# Altium schematic sheet Relay_Latches.SchDoc
size A3; SheetNumber: 4; SheetTotal: 6
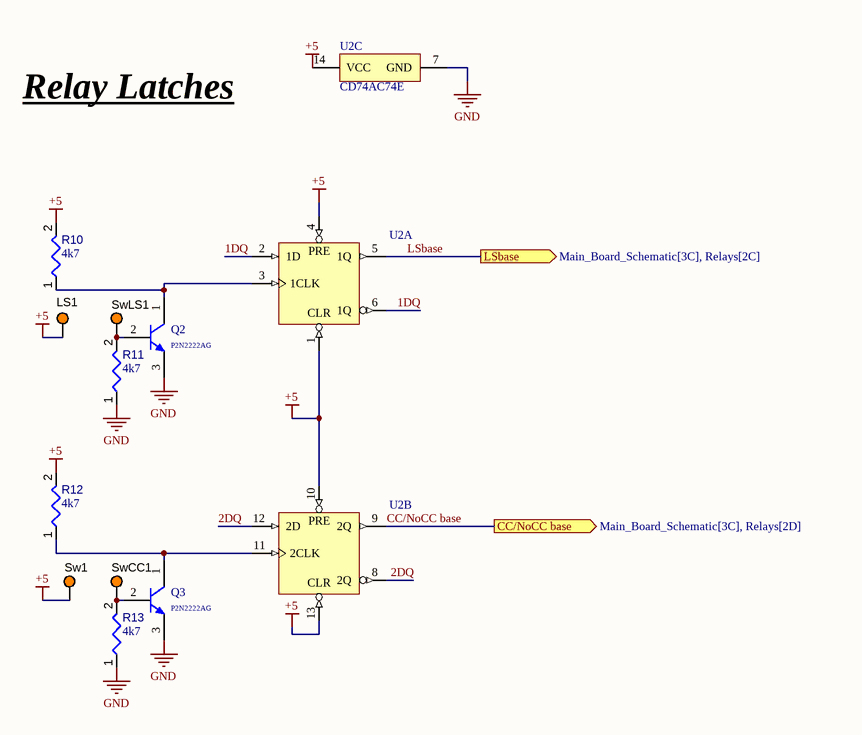
[diagram p0: Relay_Latches.SchDoc]

## Parts
LS1  5003  [KSTN-5003]  (value not drawn)
Q2  P2N2222AG  [ONSC-TO-92-3-29-11]
Q3  P2N2222AG  [ONSC-TO-92-3-29-11]
R10  value 4k7  [RESA60-630X240]  (hidden comment: MFR-25FBF52-100R)
R11  value 4k7  [RESA60-630X240]  (hidden comment: MFR-25FBF52-100R)
R12  value 4k7  [RESA60-630X240]  (hidden comment: MFR-25FBF52-100R)
R13  value 4k7  [RESA60-630X240]  (hidden comment: MFR-25FBF52-100R)
Sw1  5003  [KSTN-5003]  (value not drawn)
SwCC1  5003  [KSTN-5003]  (value not drawn)
SwLS1  5003  [KSTN-5003]  (value not drawn)
U2  CD74AC74E  [N0014A]  (value not drawn)  (parts A,B,C of 3)

## Ports
CC/NoCC base (out, see Main_Board_Schematic[3C], Relays[2D]), LSbase (out, see Main_Board_Schematic[3C], Relays[2C])

## Nets
+5: LS1.1 R10.2 R12.2 Sw1.1 U2.1(1~{CLR}) U2.4(1~{PRE}) U2.10(2~{PRE}) U2.13(2~{CLR}) U2.14(VCC)
GND: Q2.3(E) Q3.3(E) R11.1 R13.1 U2.7(GND)
1DQ: U2.2(1D) U2.6(1Q)
2DQ: U2.8(2Q) U2.12(2D)
CC/NoCC base: U2.9(2Q) ; port CC/NoCC base
LSbase: U2.5(1Q) ; port LSbase
NetQ2_1: Q2.1(C) R10.1 U2.3(1CLK)
NetQ2_2: Q2.2(B) R11.2 SwLS1.1
NetQ3_1: Q3.1(C) R12.1 U2.11(2CLK)
NetQ3_2: Q3.2(B) R13.2 SwCC1.1

## Notes on the sheet
- Relay Latches
- (in symbol CMP-1619-00741-2, part A) PRE; CLR
- (in symbol CMP-1619-00741-2, part B) PRE; CLR

## Library data of the parts
LS1 Sw1 SwCC1 SwLS1 = CMP-002-00037-2: Test Point, Orange, Height 4.6 mm, Tail Length 3 mm, 1-Pin THD, RoHS; Manufacturer: Keystone; Colour: Orange; Packaging: Bulk; Package Description: 1-Pin Through Hole Device, Dia 2.54 mm; Pins: 1; Package Reference: 5003; Datasheet Version: Jun-15; Case/Package: 5003; Mounting Technology: TH; Connector Type: TestPoint; Diameter: 2.54mm; Contact Material: Bronze; Datasheet URL: http://keyelco.com/userAssets/file/M65p56.pdf; Manufacturer URL: http://www.keyelco.com/; Package Quantity: 10; Contact Plating: Tin; RoHS Compliant: True
Q2 Q3 = CMP-1048-01402-1: Amplifier Transistor, NPN Silicon, 3-Pin TO-92, Pb-Free, Bulk Box; Manufacturer: On Semiconductor; IC Continuous (A): 0.6; fT Min (MHz): 300; ComponentLink2Description: Datasheet; ComponentLink1Description: Manufacturer URL; ComponentLink2URL: http://www.onsemi.com/pub_link/Collateral/P2N2222A-D.PDF; ComponentLink3Description: Package Specification; RoHS: TRUE; ComponentLink1URL: http://www.onsemi.com/; PartNumber: P2N2222AG; Mounting Technology: Through Hole; PackageReference: TO-92-3-29-11_AM_SL; Polarity: NPN; Packing: Bulk Box; DatasheetVersion: Rev. 7; PackageDescription: 3-Pin Transistor Outline, Body 4.825 x 3.685 mm, Pitch 1.27 mm; PackageVersion: Rev. AM; ComponentLink3URL: http://www.onsemi.cn/pub_link/Collateral/2N6426-D.PDF
R10-R13 = CMP-009-00046-4: Axial Resistor, 100 Ohm, +/- 1%, 0.25 W, -55 to 155 degC, 2-Pin THD, RoHS, Bulk; Manufacturer: Yageo; Voltage Rating: 250V; Power: 250mW; Packaging: Bulk; Max Operating Temperature: 155°C; Mounting Technology: TH; Datasheet Version: Apr-13; Case/Package: Axial; RoHS Compliant: True; Package Description: 2-Pin Axial Lead, Dia 2.4 mm, Body Length 6.3 mm; Package Quantity: 200; Package Reference: MFR-25; Tolerance: 1%; Composition: CarbonFilm; Datasheet URL: http://www.yageo.com/documents/recent/Yageo%20LR_MFR_2013.pdf; Manufacturer URL: http://www.yageo.com/; Min Operating Temperature: -55°C
U2 = CMP-1619-00741-2: Dual Positive-Edge-Triggered D-Type Flip-Flops with Set and Reset, N0014A, TUBE; Manufacturer: Texas Instruments; VCC(Min)(V): 1.5; Rating: Catalog; Voltage(Nom)(V): 1.5,3.3,5; VCC(Max)(V): 5.5; Technology Family: AC; Input Type: CMOS; ICC @ Nom Voltage(Max)(mA): 0.04; Schmitt Trigger: No; F @ Nom Voltage(Max)(Mhz): 100; Output Drive (IOL/IOH)(Max)(mA): 24/-24; Output Logic: Inverted,Non-inverted; tpd @ Nom Voltage(Max)(ns): 114,12.7,9.1; Bits(#): 2; Generic Part Number: CD74AC74; Operating Temperature Range(C): -55 to 125; Code_JEDEC: MS-001; 3-State Output: No; PackageReference: N0014A; DatasheetVersion: SCHS231D; Output Type: CMOS